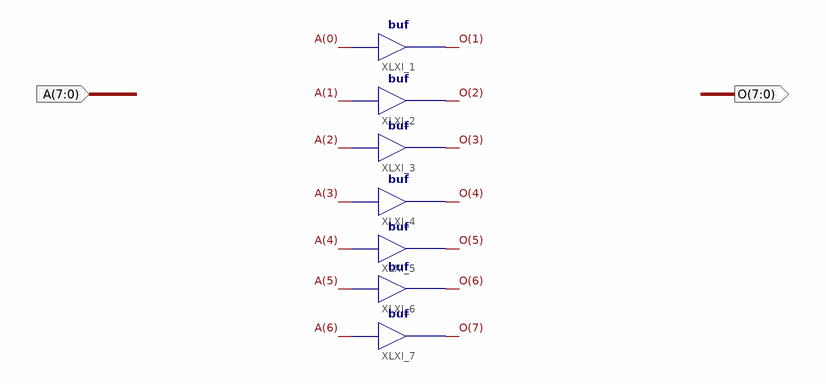
[diagram p0: schematic sheet 1]
// Xilinx ISE schematic ShiftBit.sch (spartan6) as structural Verilog: 7 symbols, 2 ports
module ShiftBit (
  input  [7:0] A,
  output [7:0] O
);

  buf XLXI_2 (O[2], A[1]);
  buf XLXI_3 (O[3], A[2]);
  buf XLXI_4 (O[4], A[3]);
  buf XLXI_5 (O[5], A[4]);
  buf XLXI_6 (O[6], A[5]);
  buf XLXI_7 (O[7], A[6]);
  buf XLXI_1 (O[1], A[0]);
endmodule
